# Altium project Transmitter_E-Stop Project.PrjPcb
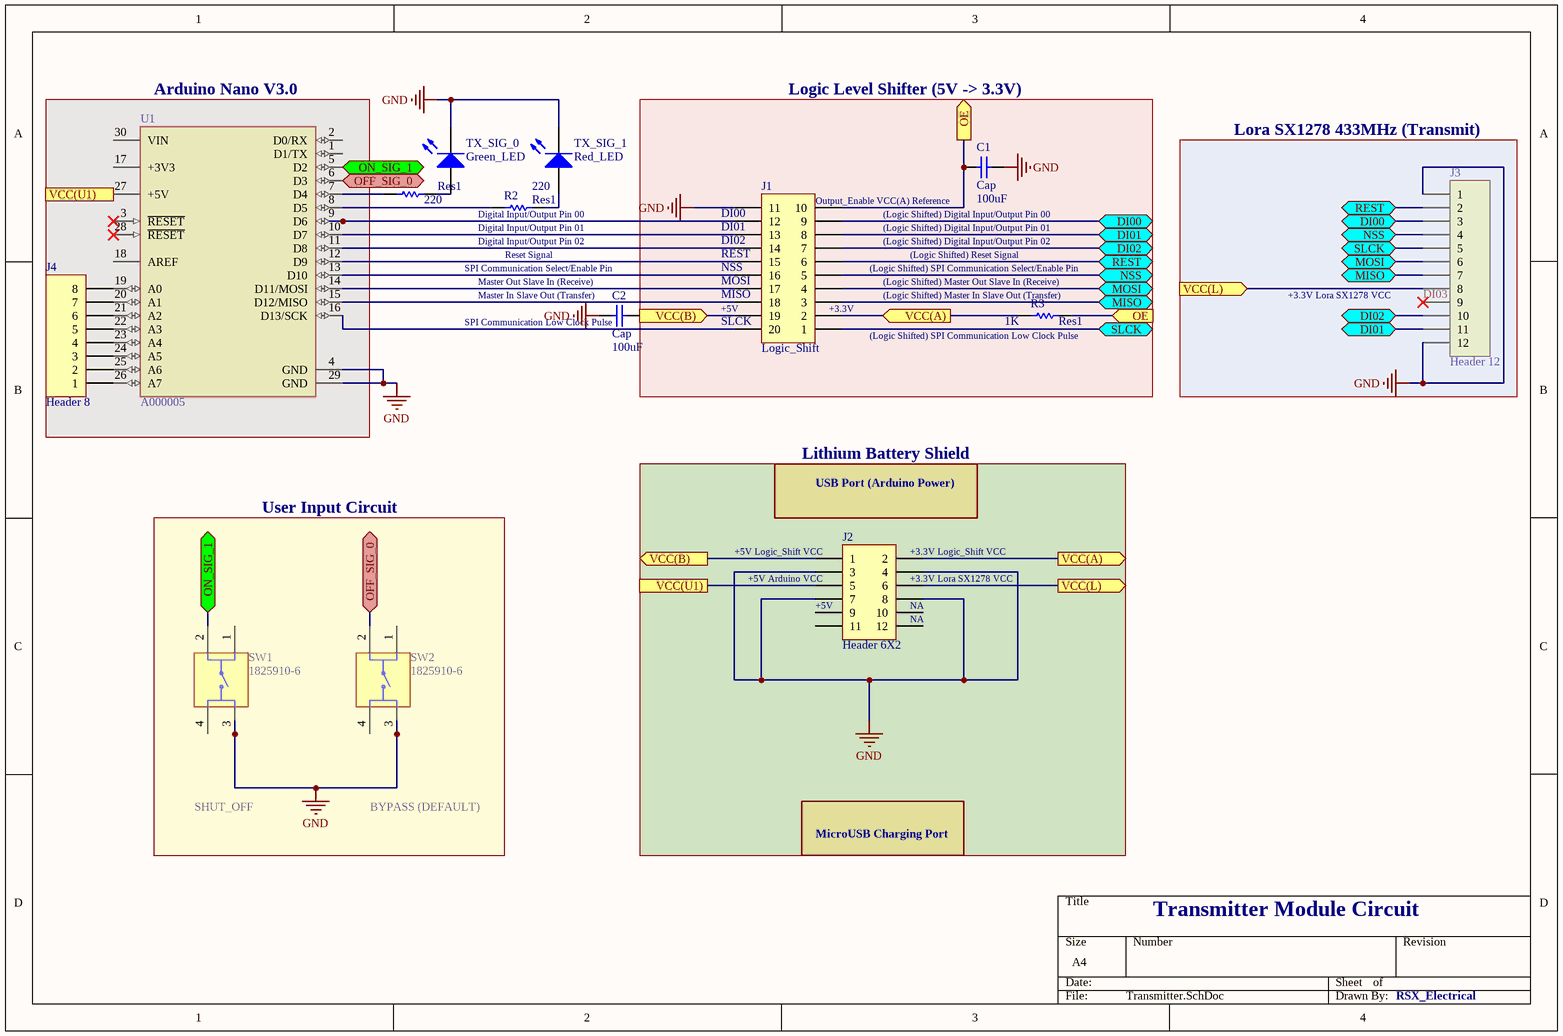
[diagram p0: Transmitter.SchDoc]
1 sheet, 14 parts. Net scope: flat (ports and power ports of the same name join across sheets).
Board file: Transmitter_PCB.PcbDoc

## Sheet Transmitter.SchDoc
size A4; SheetNumber: 1; SheetTotal: 1; SPICEModelCacheDROQVVJG: <root> / <DocumentId>DROQVVJG</DocumentId> / <CacheFrame Number="0"> / <Model Name="cap" Kind="MDL"> / <Text>*Default semiconductor capacitor / .MODEL CAP C()</Text> / </Model> / </CacheFrame> / </root>

### Parts
C1  Cap  value 100uF  [RAD-0.3]
C2  Cap  value 100uF  [RAD-0.3]
J1  Logic_Shift  [DIP2SSOP20]
J2  Header 6X2  [3.3V/5V Battery Shield - duplicate]
J3  Header 12  [LORA Sx1278]
J4  Header 8  [HDR1X8]
R1  Res1  value 220  [AXIAL-0.3]
R2  Res1  value 220  [AXIAL-0.3]
R3  Res1  value 1K  [AXIAL-0.3]
SW1  1825910-6  [SW_1825910-6-4]
SW2  1825910-6  [SW_1825910-6-4]
TX_SIG_0  Green_LED  [LED-0]
TX_SIG_1  Red_LED  [LED-0]
U1  A000005  [FP-A000005-MFG]

### Blocks framed on the sheet
Arduino Nano V3.0: J4 U1
Logic Level Shifter (5V -> 3.3V): C1 J1 R3
Lora SX1278 433MHz (Transmit): J3
User Input Circuit: SW1 SW2
Lithium Battery Shield: J2

### Ports
DI00 (bidir), DI01 (bidir), DI02 (bidir), MISO (bidir), MOSI (bidir), NSS (bidir), OE (in), OE (out), OFF_SIG_0 (bidir), ON_SIG_1 (bidir), REST (bidir), SLCK (bidir), VCC(A) (in), VCC(A) (out), VCC(B) (in), VCC(B) (out), VCC(L) (in), VCC(L) (out), VCC(U1)

### Nets
GND: C1.2 C2.1 J1.11 J2.3 J2.4 J2.7 J2.8 J3.1 J3.12 SW1.3 SW2.3 TX_SIG_0.2(K) TX_SIG_1.2(K) U1.4(GND) U1.29(GND)
DI03: J3.9
NetC1_1: C1.1 J1.10 R3.1 ; port OE
NetC2_2: C2.2 J1.19 J2.1 ; port VCC(B)
NetJ1_1: J1.1 J3.5 ; port SLCK
NetJ1_2: J1.2 J2.2 R3.2 ; port VCC(A)
NetJ1_3: J1.3 J3.7 ; port MISO
NetJ1_4: J1.4 J3.6 ; port MOSI
NetJ1_5: J1.5 J3.4 ; port NSS
NetJ1_6: J1.6 J3.2 ; port REST
NetJ1_7: J1.7 J3.10 ; port DI02
NetJ1_8: J1.8 J3.11 ; port DI01
NetJ1_9: J1.9 J3.3 ; port DI00
NetJ1_12: J1.12 U1.9(D6)
NetJ1_13: J1.13 U1.10(D7)
NetJ1_14: J1.14 U1.11(D8)
NetJ1_15: J1.15 U1.12(D9)
NetJ1_16: J1.16 U1.13(D10)
NetJ1_17: J1.17 U1.14(D11/MOSI)
NetJ1_18: J1.18 U1.15(D12/MISO)
NetJ1_20: J1.20 U1.16(D13/SCK)
NetJ2_5: J2.5 U1.27(+5V) ; port VCC(U1)
NetJ2_6: J2.6 J3.8 ; port VCC(L)
NetJ4_1: J4.1 U1.26(A7)
NetJ4_2: J4.2 U1.25(A6)
NetJ4_3: J4.3 U1.24(A5)
NetJ4_4: J4.4 U1.23(A4)
NetJ4_5: J4.5 U1.22(A3)
NetJ4_6: J4.6 U1.21(A2)
NetJ4_7: J4.7 U1.20(A1)
NetJ4_8: J4.8 U1.19(A0)
NetR1_1: R1.1 TX_SIG_0.1(A)
NetR1_2: R1.2 U1.7(D4)
NetR2_1: R2.1 TX_SIG_1.1(A)
NetR2_2: R2.2 U1.8(D5)
NetSW1_2: SW1.2 U1.5(D2) ; port ON_SIG_1
NetSW2_2: SW2.2 U1.6(D3) ; port OFF_SIG_0

Not connected (* = marked no-connect by the designer): J2 9 10 11 12; SW1 1 4; SW2 1 4; U1 1(D1/TX) 2(D0/RX) 3(~{RESET})* 17(+3V3) 18(AREF) 28(~{RESET})* 30(VIN)

### Notes on the sheet
- (near R2) Digital Input/Output Pin 00
- (near R2) Digital Input/Output Pin 01
- (near R2) Digital Input/Output Pin 02
- (near J1) DI00
- (near J1) DI01
- (near J1) DI02
- (near J1) Output_Enable VCC(A) Reference
- (Logic Shifted) Digital Input/Output Pin 00
- (Logic Shifted) Digital Input/Output Pin 01
- (Logic Shifted) Digital Input/Output Pin 02
- SPI Communication Select/Enable Pin
- (near C2) Master Out Slave In (Receive)
- (near C2) Master In Slave Out (Transfer)
- (near R2) Reset Signal
- (near J1) +5V
- (near J1) REST
- (near J1) NSS
- (near J1) MOSI
- (near J1) MISO
- (near J1) +3.3V
- (Logic Shifted) SPI Communication Select/Enable Pin
- (near R3) (Logic Shifted) Master Out Slave In (Receive)
- (near R3) (Logic Shifted) Master In Slave Out (Transfer)
- (Logic Shifted) Reset Signal
- +3.3V Lora SX1278 VCC
- (near C2) SPI Communication Low Clock Pulse
- (near J1) SLCK
- (near R3) (Logic Shifted) SPI Communication Low Clock Pulse
- USB Port (Arduino Power)
- (near J2) +5V Logic_Shift VCC
- (near J2) +5V Arduino VCC
- (near J2) +3.3V Logic_Shift VCC
- (near J2) +3.3V Lora SX1278 VCC
- (near J2) +5V
- (near J2) NA
- SHUT_OFF
- BYPASS (DEFAULT)
- MicroUSB Charging Port
- Transmitter Module Circuit
- RSX_Electrical

### Library data of the parts
C1 C2 = Cap: Capacitor; Published: 8-Jun-2000; LatestRevisionDate: 17-Jul-2002; LatestRevisionNote: Re-released for DXP Platform.; PackageReference: RAD-0.3; Publisher: Altium Limited; PackageDescription: Radial Cap, Thru-Hole; 2 Leads; 0.3 in Pin Spacing
J1 = Header 10X2: Header, 10-Pin, Dual row; LatestRevisionDate: 17-Jul-2002; LatestRevisionNote: Re-released for DXP Platform.; Publisher: Altium Limited
J2 = Header 6X2: Header, 6-Pin, Dual row; LatestRevisionDate: 17-Jul-2002; LatestRevisionNote: Re-released for DXP Platform.; Publisher: Altium Limited
J3 = Header 12: Header, 12-Pin; LatestRevisionDate: 17-Jul-2002; LatestRevisionNote: Re-released for DXP Platform.; Publisher: Altium Limited
J4 = Header 8: Header, 8-Pin; LatestRevisionDate: 17-Jul-2002; LatestRevisionNote: Re-released for DXP Platform.; Publisher: Altium Limited
R1-R3 = Res1: Resistor; Published: 8-Jun-2000; LatestRevisionDate: 17-Jul-2002; LatestRevisionNote: Re-released for DXP Platform.; PackageReference: AXIAL-0.3; Publisher: Altium Limited; PackageDescription: Axial Device, Thru-Hole; 2 Leads; 0.3 in Pin Spacing
SW1 SW2 = 1825910-6: Switch Tactile OFF (ON) SPST Round Button PC Pins 0.05A 24VDC 100000Cycles 1.57N Thru-Hole Loose; Package: None; MP: 1825910-6; Value: *; Price: None; Availability: Unavailable
TX_SIG_0 TX_SIG_1 = LED0: Typical INFRARED GaAs LED; Published: 8-Jun-2000; LatestRevisionDate: 08-Jul-2005; LatestRevisionNote: Mech Layer 1 removed.; PackageReference: LED-0; Publisher: Altium Limited; PackageDescription: LED; 2 Leads
U1 = CMP-189986-000002-1: ARDUINO NANO ATMEGA328 EVAL BRD; Number of Bits: 8; Evaluation Kit: Yes; Operating Supply Voltage: 12V; Interface: I2C; Data Bus Width: 8b; Core Architecture: AVR; Packaging: Bulk; Length: 7inch; Package Quantity: 50; Width: 5inch; REACH SVHC: No SVHC; Weight: 0.358383oz; Series: AVR® ATmega; Height: 0.25inch